# EAGLE schematic V4-AddOnSduino-V003 (EAGLE 9.3.0)
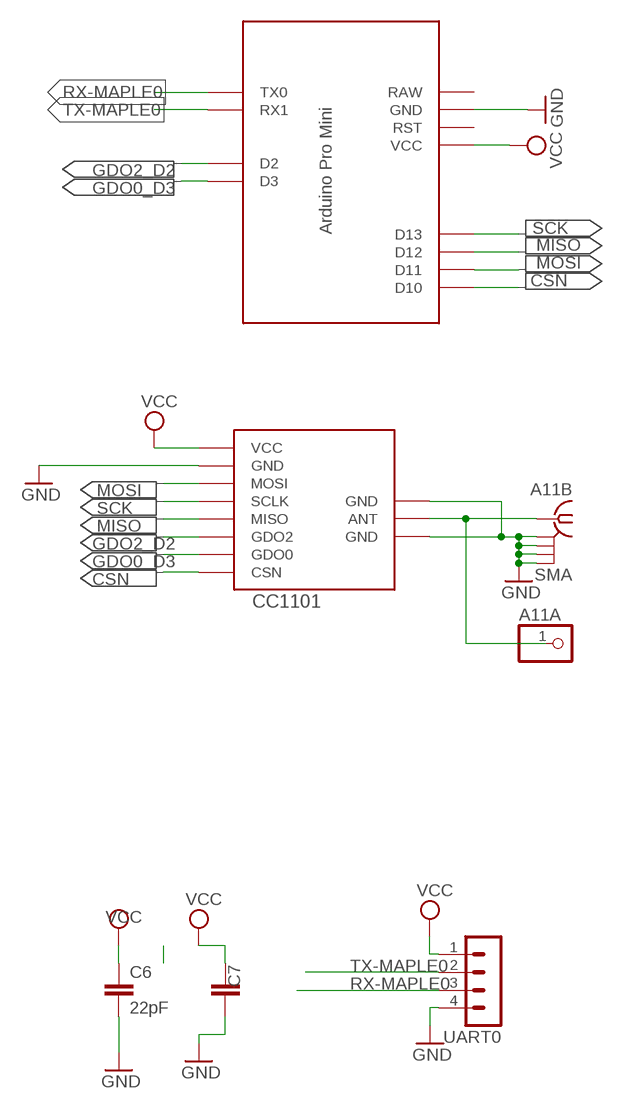
[diagram p0: schematic, sheet 1]

## Parts
A11A  PINHD-1X1  [1X01]
A11B  SMA  [SMA]
C6  22pF  C-EUC0805  [C0805]
C7  C-EUC1812  [C1812]
CC1101  CC1101_MODULE1SMD  [CC1101_MODULE1_SMD]
U$2  MARTIN-PROMINI-CC1101  [MARTIN-PRO-CC1101]
UART0  MA04-1  [MA04-1]

## Nets
ANT1: A11A.1 A11B.1 CC1101.ANT
CSN: CC1101.CSN U$2.D10
GDO0_D3: CC1101.GDO0 U$2.D3
GDO2_D2: CC1101.GDO2 U$2.D2
GND [PWR]: A11B.GND@1 A11B.GND@2 A11B.GND@3 A11B.GND@4 C6.2 C7.1 CC1101.GND@0(GND) CC1101.GND@1(GND) CC1101.GND@2(GND) U$2.GND UART0.4
MISO: CC1101.MISO U$2.D12
MOSI: CC1101.MOSI U$2.D11
RX-MAPLE0: U$2.TX0 UART0.3
SCK: CC1101.SCLK U$2.D13
TX-MAPLE0: U$2.RX1 UART0.2
VCC [PWR]: C6.1 C7.2 CC1101.VCC U$2.VCC UART0.1
Unconnected: U$2.RAW U$2.RST

## Library data of the parts
A11A = pinhead:PINHD-1X1: PIN HEADER
A11B = wireless:SMA: SMA 50 Ohm end launch jack receptacle - round contact
C6 C7 = rcl:C-EU: CAPACITOR, European symbol; SPICEPREFIX: C
CC1101 = CC1101:CC1101_MODULE1: CC1101 wireless module for 433/868 MHz (sold from Aliexpress). DIL version for mounting with pin header (and SMD soldering) and SMD only variant available.
U$2 = Arduino-clone:MARTIN-PROMINI-CC1101
UART0 = con-lstb:MA04-1: PIN HEADER; OC_FARNELL: unknown; OC_NEWARK: unknown

## Net classes
0 default: width 0.305 mm
1 PWR: width 0.61 mm